# EAGLE schematic SL530 (EAGLE 8.1.1)

## Sheet 1 of 2
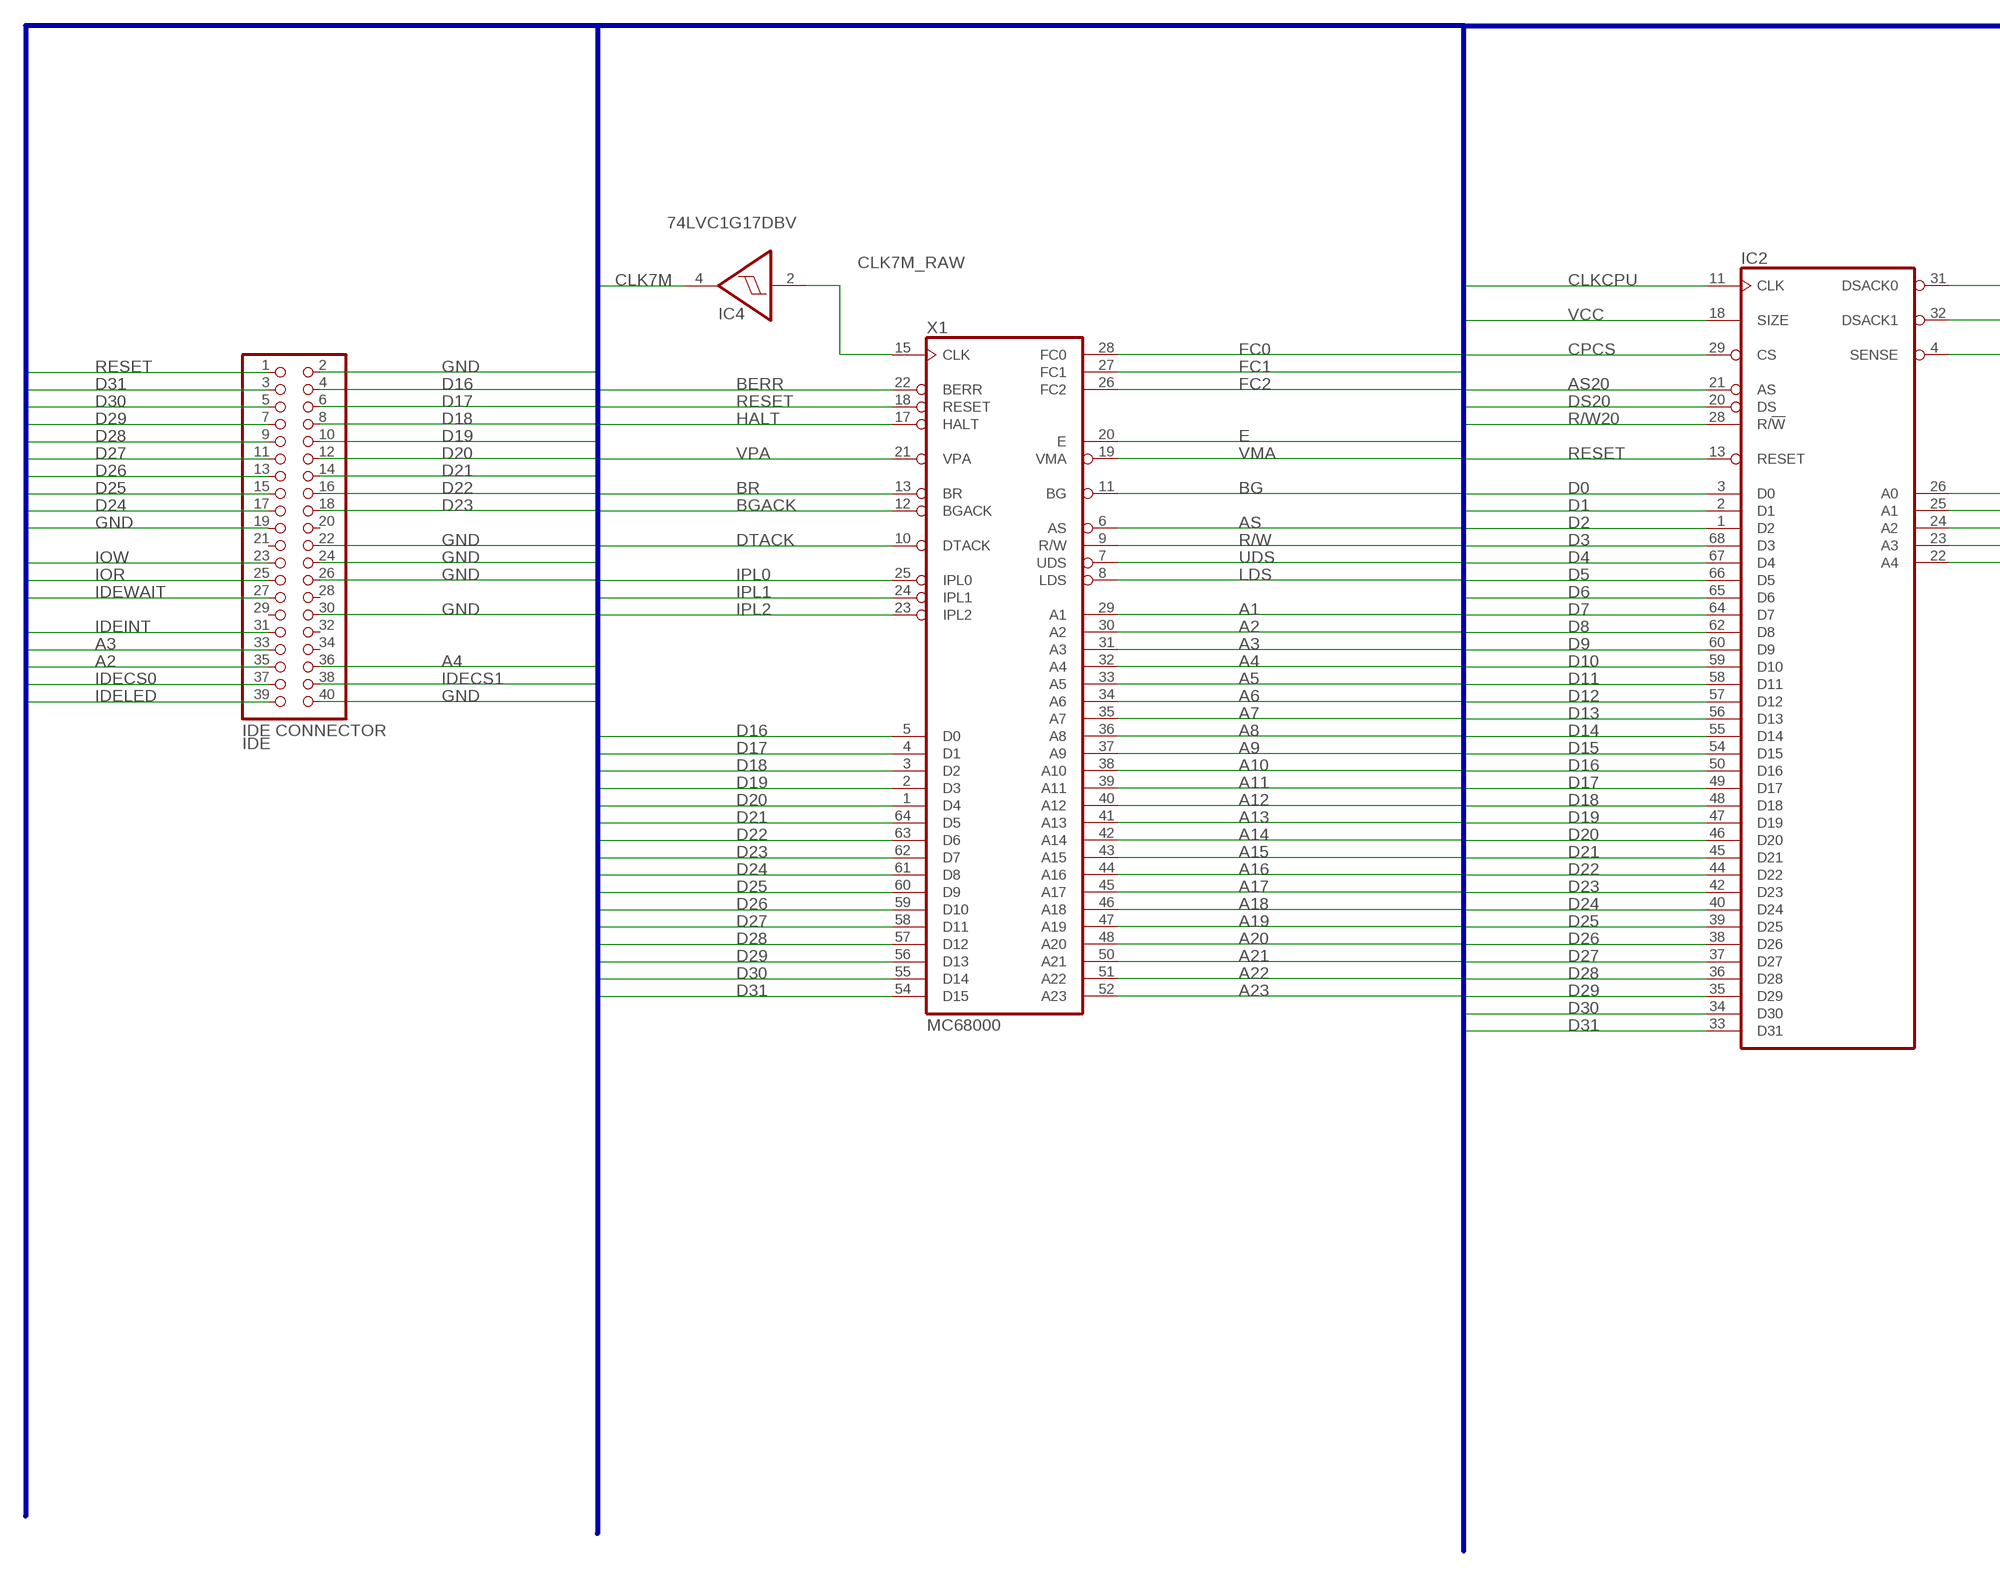
[diagram p0: schematic, sheet 1, part 1 of 2]
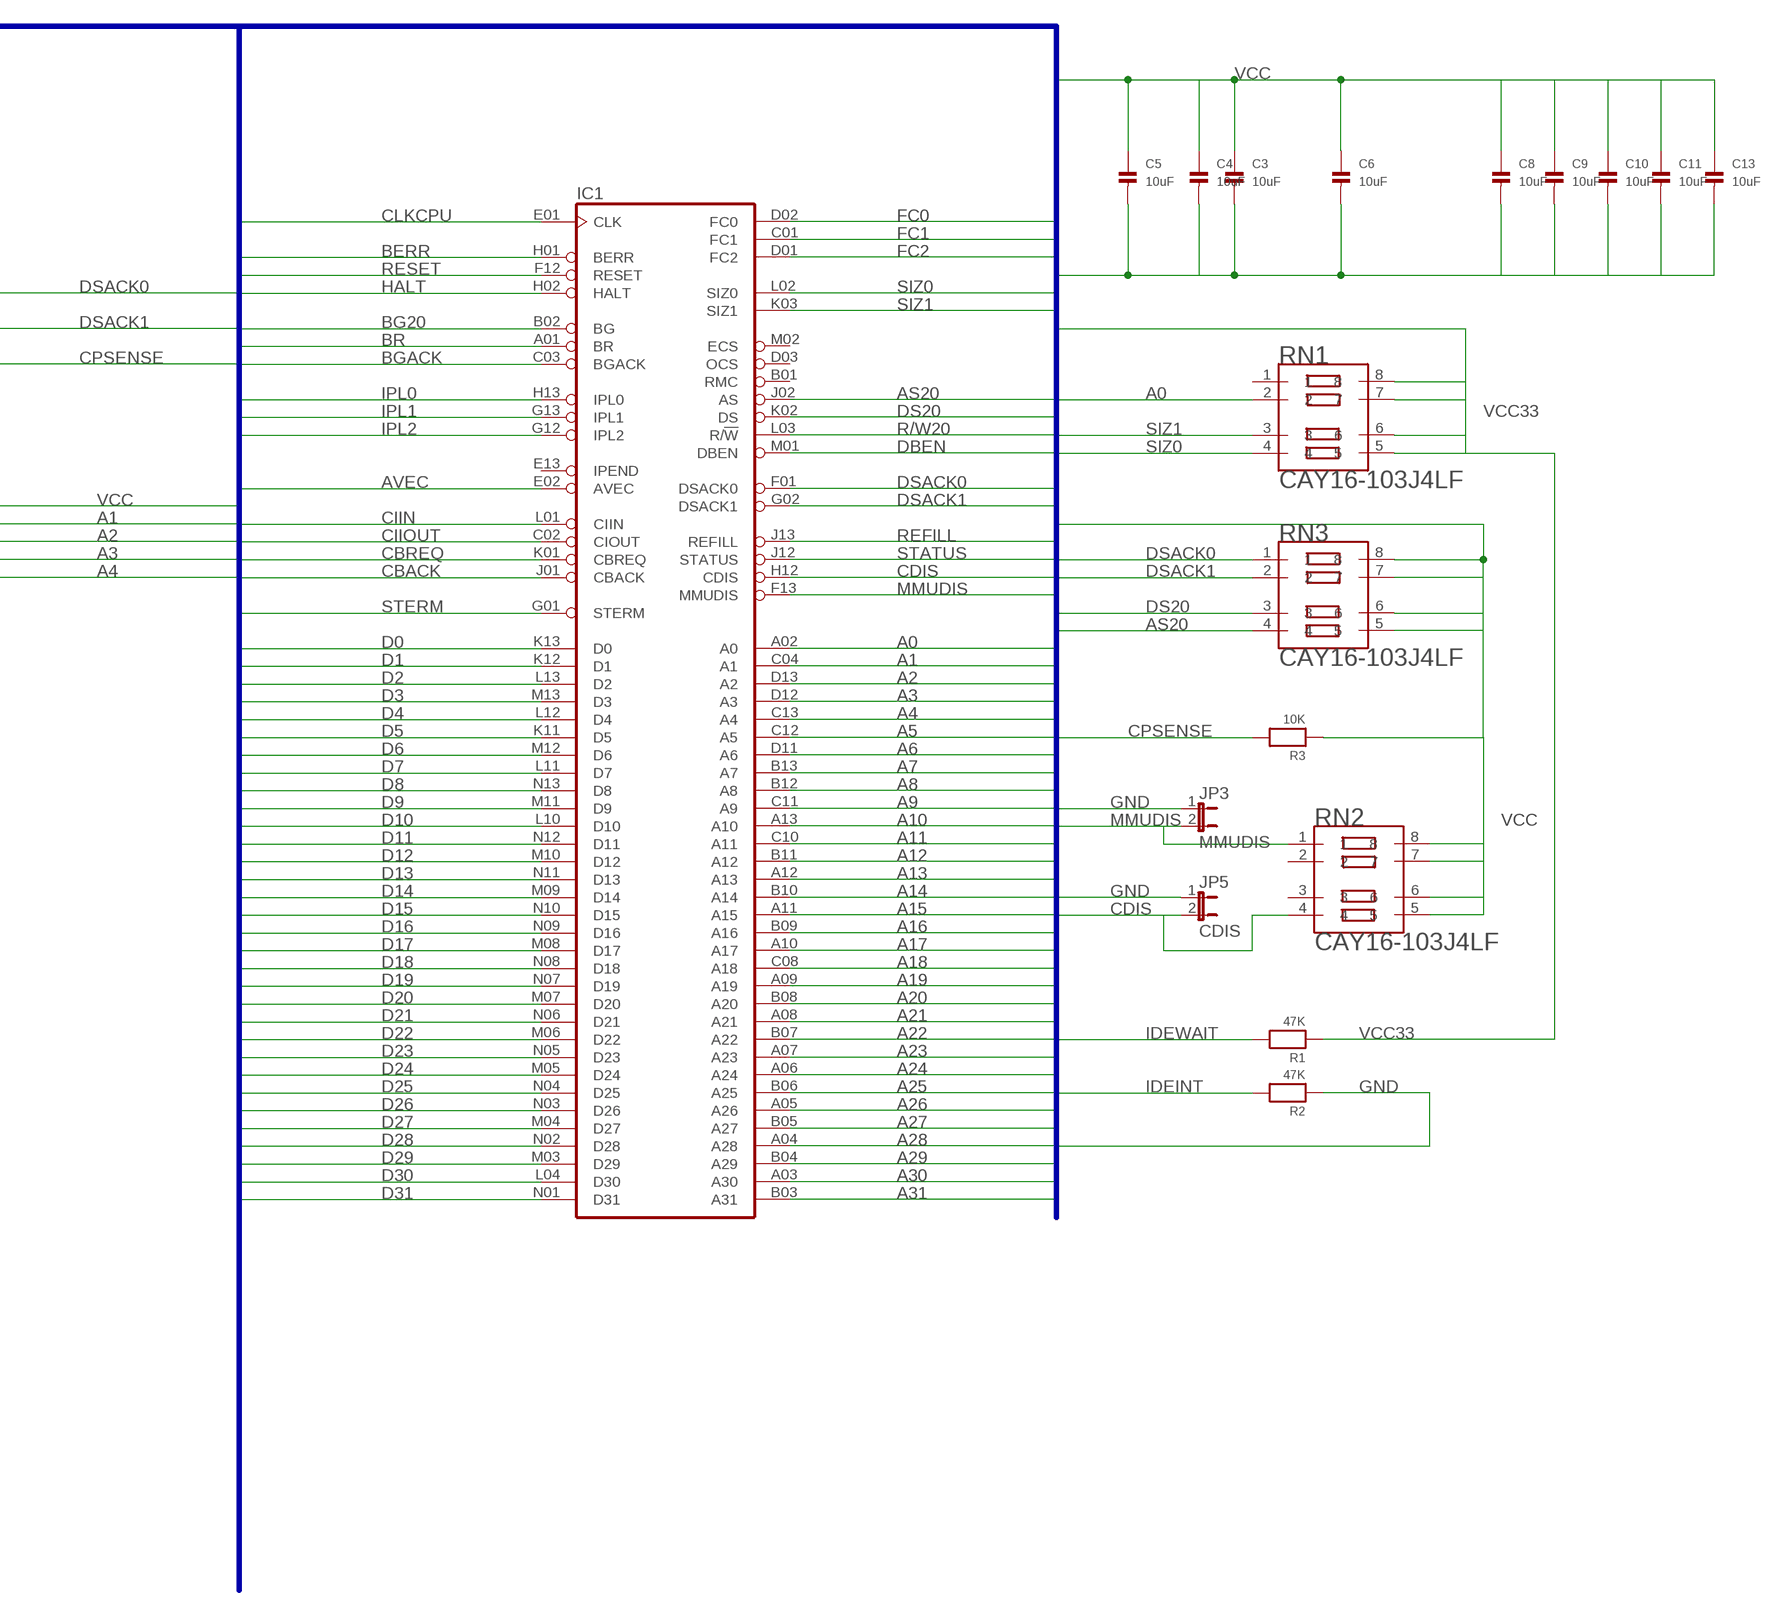
[diagram p1: schematic, sheet 1, part 2 of 2]

### Parts
C3  10uF  CAP_CERAMIC1206  [1206]
C4  10uF  CAP_CERAMIC1206  [1206]
C5  10uF  CAP_CERAMIC1206  [1206]
C6  10uF  CAP_CERAMIC1206  [1206]
C8  10uF  CAP_CERAMIC1206  [1206]
C9  10uF  CAP_CERAMIC1206  [1206]
C10  10uF  CAP_CERAMIC1206  [1206]
C11  10uF  CAP_CERAMIC1206  [1206]
C13  10uF  CAP_CERAMIC1206  [1206]
IC1  MC68030RC  [MPGA128]
IC2  MC68881FN-SOC  [PLCC68-S]
IC4  74LVC1G17DBV  [SOT23-5]
IDE  IDE CONNECTOR  PINHD-2X20  [2X20]
JP3  MMUDIS  JUMPER-2PTH  [1X02]
JP5  CDIS  JUMPER-2PTH  [1X02]
R1  47K  RESISTOR1206  [1206]
R2  47K  RESISTOR1206  [1206]
R3  10K  RESISTOR1206  [1206]
RN1  CAY16-103J4LF  [RESCAXE80P320X160-8N]
RN2  CAY16-103J4LF  [RESCAXE80P320X160-8N]
RN3  CAY16-103J4LF  [RESCAXE80P320X160-8N]
X1  MC68000  MC68000P  [DIL64]

### Nets
A0: IC1.A02(A0) RN1.2 ; also sheet 2
A1: IC1.C04(A1) IC2.25(A1) X1.29(A1) ; also sheet 2
A2: IC1.D13(A2) IC2.24(A2) IDE.35 X1.30(A2) ; also sheet 2
A3: IC1.D12(A3) IC2.23(A3) IDE.33 X1.31(A3) ; also sheet 2
A4: IC1.C13(A4) IC2.22(A4) IDE.36 X1.32(A4) ; also sheet 2
A5: IC1.C12(A5) X1.33(A5) ; also sheet 2
A6: IC1.D11(A6) X1.34(A6) ; also sheet 2
A7: IC1.B13(A7) X1.35(A7) ; also sheet 2
A8: IC1.B12(A8) X1.36(A8) ; also sheet 2
A9: IC1.C11(A9) X1.37(A9) ; also sheet 2
A10: IC1.A13(A10) X1.38(A10) ; also sheet 2
A11: IC1.C10(A11) X1.39(A11) ; also sheet 2
A12: IC1.B11(A12) X1.40(A12) ; also sheet 2
A13: IC1.A12(A13) X1.41(A13) ; also sheet 2
A14: IC1.B10(A14) X1.42(A14) ; also sheet 2
A15: IC1.A11(A15) X1.43(A15) ; also sheet 2
A16: IC1.B09(A16) X1.44(A16) ; also sheet 2
A17: IC1.A10(A17) X1.45(A17) ; also sheet 2
A18: IC1.C08(A18) X1.46(A18) ; also sheet 2
A19: IC1.A09(A19) X1.47(A19) ; also sheet 2
A20: IC1.B08(A20) X1.48(A20) ; also sheet 2
A21: IC1.A08(A21) X1.50(A21) ; also sheet 2
A22: IC1.B07(A22) X1.51(A22) ; also sheet 2
A23: IC1.A07(A23) X1.52(A23) ; also sheet 2
A24: IC1.A06(A24)
A25: IC1.B06(A25)
A26: IC1.A05(A26)
A27: IC1.B05(A27)
A28: IC1.A04(A28)
A29: IC1.B04(A29)
A30: IC1.A03(A30)
A31: IC1.B03(A31)
AS: X1.6(AS) ; also sheet 2
AS20: IC1.J02(AS) IC2.21(AS) RN3.4 ; also sheet 2
AVEC: IC1.E02(AVEC) ; also sheet 2
BERR: IC1.H01(BERR) X1.22(BERR) ; also sheet 2
BG: X1.11(BG) ; also sheet 2
BG20: IC1.B02(BG) ; also sheet 2
BGACK: IC1.C03(BGACK) X1.12(BGACK) ; also sheet 2
BR: IC1.A01(BR) X1.13(BR)
CBACK: IC1.J01(CBACK) ; also sheet 2
CBREQ: IC1.K01(CBREQ) ; also sheet 2
CDIS: IC1.H12(CDIS) JP5.2 RN2.4
CIIN: IC1.L01(CIIN) ; also sheet 2
CIIOUT: IC1.C02(CIOUT)
CLK7M: IC4.4(O) ; also sheet 2
CLK7M_RAW: IC4.2(I) X1.15(CLK)
CLKCPU: IC1.E01(CLK) IC2.11(CLK) ; also sheet 2
CPCS: IC2.29(CS) ; also sheet 2
CPSENSE: IC2.4(SENSE) R3.2 ; also sheet 2
D0: IC1.K13(D0) IC2.3(D0) ; also sheet 2
D1: IC1.K12(D1) IC2.2(D1) ; also sheet 2
D2: IC1.L13(D2) IC2.1(D2) ; also sheet 2
D3: IC1.M13(D3) IC2.68(D3) ; also sheet 2
D4: IC1.L12(D4) IC2.67(D4) ; also sheet 2
D5: IC1.K11(D5) IC2.66(D5) ; also sheet 2
D6: IC1.M12(D6) IC2.65(D6) ; also sheet 2
D7: IC1.L11(D7) IC2.64(D7) ; also sheet 2
D8: IC1.N13(D8) IC2.62(D8) ; also sheet 2
D9: IC1.M11(D9) IC2.60(D9) ; also sheet 2
D10: IC1.L10(D10) IC2.59(D10) ; also sheet 2
D11: IC1.N12(D11) IC2.58(D11) ; also sheet 2
D12: IC1.M10(D12) IC2.57(D12) ; also sheet 2
D13: IC1.N11(D13) IC2.56(D13) ; also sheet 2
D14: IC1.M09(D14) IC2.55(D14) ; also sheet 2
D15: IC1.N10(D15) IC2.54(D15) ; also sheet 2
D16: IC1.N09(D16) IC2.50(D16) IDE.4 X1.5(D0) ; also sheet 2
D17: IC1.M08(D17) IC2.49(D17) IDE.6 X1.4(D1) ; also sheet 2
D18: IC1.N08(D18) IC2.48(D18) IDE.8 X1.3(D2) ; also sheet 2
D19: IC1.N07(D19) IC2.47(D19) IDE.10 X1.2(D3) ; also sheet 2
D20: IC1.M07(D20) IC2.46(D20) IDE.12 X1.1(D4) ; also sheet 2
D21: IC1.N06(D21) IC2.45(D21) IDE.14 X1.64(D5) ; also sheet 2
D22: IC1.M06(D22) IC2.44(D22) IDE.16 X1.63(D6) ; also sheet 2
D23: IC1.N05(D23) IC2.42(D23) IDE.18 X1.62(D7) ; also sheet 2
D24: IC1.M05(D24) IC2.40(D24) IDE.17 X1.61(D8) ; also sheet 2
D25: IC1.N04(D25) IC2.39(D25) IDE.15 X1.60(D9) ; also sheet 2
D26: IC1.N03(D26) IC2.38(D26) IDE.13 X1.59(D10) ; also sheet 2
D27: IC1.M04(D27) IC2.37(D27) IDE.11 X1.58(D11) ; also sheet 2
D28: IC1.N02(D28) IC2.36(D28) IDE.9 X1.57(D12) ; also sheet 2
D29: IC1.M03(D29) IC2.35(D29) IDE.7 X1.56(D13) ; also sheet 2
D30: IC1.L04(D30) IC2.34(D30) IDE.5 X1.55(D14) ; also sheet 2
D31: IC1.N01(D31) IC2.33(D31) IDE.3 X1.54(D15) ; also sheet 2
DBEN: IC1.M01(DBEN)
DS20: IC1.K02(DS) IC2.20(DS) RN3.3 ; also sheet 2
DSACK0: IC1.F01(DSACK0) IC2.31(DSACK0) RN3.1 ; also sheet 2
DSACK1: IC1.G02(DSACK1) IC2.32(DSACK1) RN3.2 ; also sheet 2
DTACK: X1.10(DTACK) ; also sheet 2
E: X1.20(E) ; also sheet 2
FC0: IC1.D02(FC0) X1.28(FC0) ; also sheet 2
FC1: IC1.C01(FC1) X1.27(FC1) ; also sheet 2
FC2: IC1.D01(FC2) X1.26(FC2) ; also sheet 2
GND: C3.2 C4.2 C5.2 C6.2 C8.2 C9.2 C10.2 C11.2 C13.2 IDE.2 IDE.19 IDE.22 IDE.24 IDE.26 IDE.30 IDE.40 JP3.1 JP5.1 R2.1 ; also sheet 2
HALT: IC1.H02(HALT) X1.17(HALT) ; also sheet 2
IDECS0: IDE.37 ; also sheet 2
IDECS1: IDE.38 ; also sheet 2
IDEINT: IDE.31 R2.2 ; also sheet 2
IDELED: IDE.39
IDEWAIT: IDE.27 R1.2 ; also sheet 2
IOR: IDE.25 ; also sheet 2
IOW: IDE.23 ; also sheet 2
IPL0: IC1.H13(IPL0) X1.25(IPL0)
IPL1: IC1.G13(IPL1) X1.24(IPL1)
IPL2: IC1.G12(IPL2) X1.23(IPL2)
LDS: X1.8(LDS) ; also sheet 2
MMUDIS: IC1.F13(MMUDIS) JP3.2 RN2.1
R/W: X1.9(R/W) ; also sheet 2
R/W20: IC1.L03(R/!W) IC2.28(R/!W) ; also sheet 2
REFILL: IC1.J13(REFILL)
RESET: IC1.F12(RESET) IC2.13(RESET) IDE.1 X1.18(RESET) ; also sheet 2
SIZ0: IC1.L02(SIZ0) RN1.4 ; also sheet 2
SIZ1: IC1.K03(SIZ1) RN1.3 ; also sheet 2
STATUS: IC1.J12(STATUS)
STERM: IC1.G01(STERM) ; also sheet 2
UDS: X1.7(UDS) ; also sheet 2
VCC: C3.1 C4.1 C5.1 C6.1 C8.1 C9.1 C10.1 C11.1 C13.1 IC2.18(SIZE) IC2.26(A0) R3.1 RN2.5 RN2.6 RN2.7 RN2.8 RN3.5 RN3.6 RN3.7 RN3.8 ; also sheet 2
VCC33: R1.1 RN1.5 RN1.6 RN1.7 RN1.8 ; also sheet 2
VMA: X1.19(VMA) ; also sheet 2
VPA: X1.21(VPA) ; also sheet 2
Unconnected: IC1.B01(RMC) IC1.D03(OCS) IC1.E13(IPEND) IC1.M02(ECS) IDE.20 IDE.21 IDE.28 IDE.29 IDE.32 IDE.34 RN1.1 RN2.2 RN2.3

### Buses
VCC33,VCC,GND,CLK7M,A[0..31],D[0..31],IPL[0..2],FC[0..2],DSACK[0..1],BR,BGACK,R/W20,R/W,CLKCPU,AS20,DS20,BG20,AVEC,SIZ[0..1],DBEN,BERR,RESET,HALT,BG,VPA,VMA,E,AS,UDS,LDS,DTACK,CPCS,CPSENSE,CDIS,MMUDIS,IOR,IOW,INT2,IDECS[0..1],IDELED,IDEWAIT,IDEINT,RAMOE,RAMCS[0..3],INTSIG[0..4],TCK,TMS,TDI,TDO,TDINT,OVL,CIIN,CIIOUT,CBREQ,CBACK,STERM,STATUS,REFILL,SPI_MOSI,SPI_MISO,SPI_CLK,SPI_CS[0..1],UNDECIDED

## Sheet 2 of 2
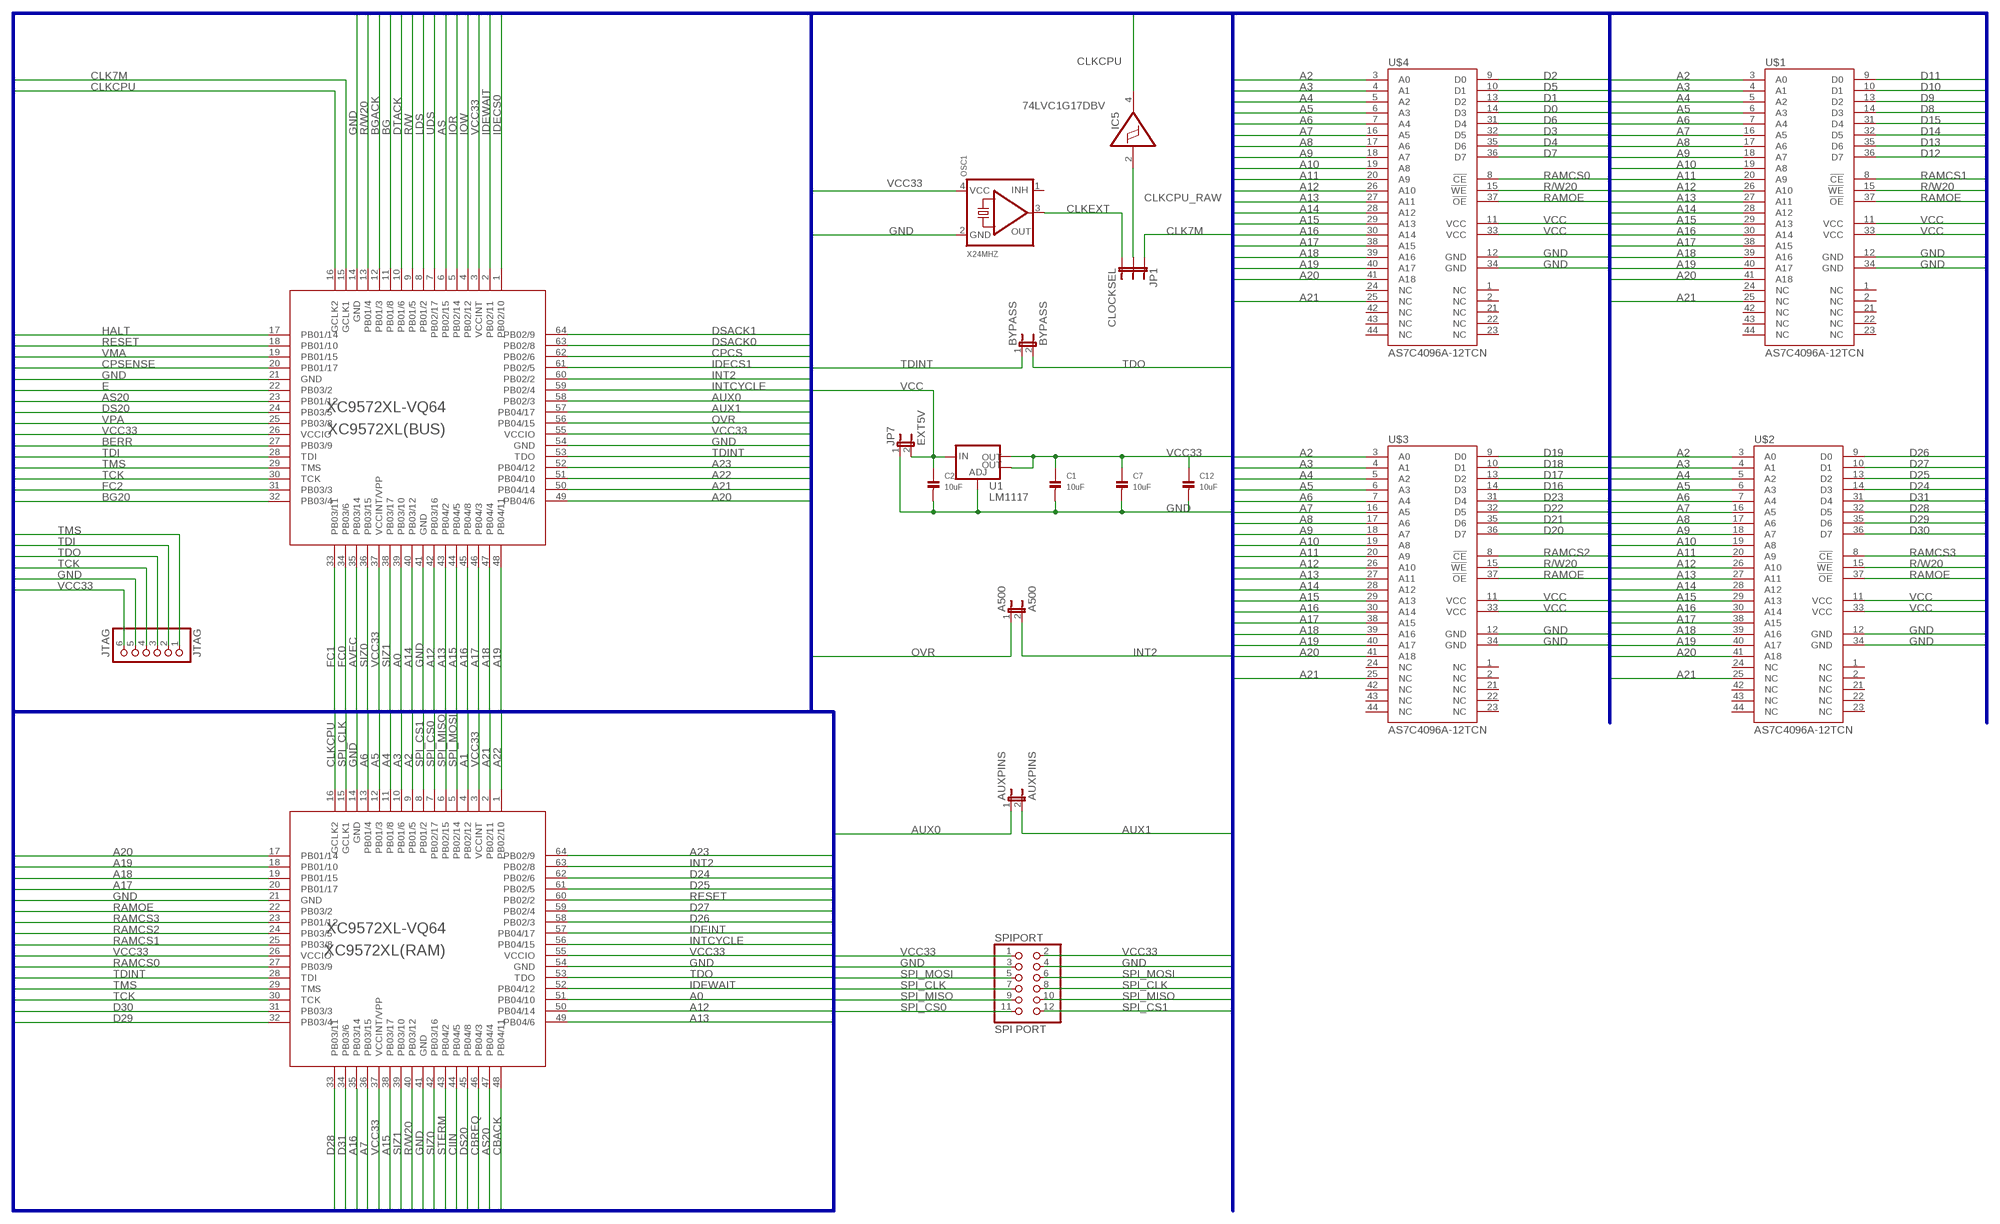
[diagram p2: schematic, sheet 2]

### Parts
A500  A500  JUMPER-2PTH  [1X02]
AUXPINS  AUXPINS  JUMPER-2PTH  [1X02]
BYPASS  BYPASS  JUMPER-2PTH  [1X02]
C1  10uF  CAP_CERAMIC1206  [1206]
C2  10uF  CAP_CERAMIC1206  [1206]
C7  10uF  CAP_CERAMIC1206  [1206]
C12  10uF  CAP_CERAMIC1206  [1206]
IC5  74LVC1G17DBV  [SOT23-5]
JP1  CLOCKSEL  JUMPER-3PTH  [1X03]
JP7  EXT5V  JUMPER-2PTH  [1X02]
JTAG  JTAG  HEADER-1X6ROUND  [1X06_ROUND]
OSC1  X24MHZ  OSCILLATOR  [OSC_7X5MM]
SPIPORT  SPI PORT  PINHD-2X6  [2X06]
U1  LM1117  V_REG_LM1117SOT223  [SOT223]
U$1  AS7C4096A-12TCN  [TSOP44-II]
U$2  AS7C4096A-12TCN  [TSOP44-II]
U$3  AS7C4096A-12TCN  [TSOP44-II]
U$4  AS7C4096A-12TCN  [TSOP44-II]
XC9572XL(BUS)  XC9572XL-VQ64  [VQ64]
XC9572XL(RAM)  XC9572XL-VQ64  [VQ64]

### Nets
A0: XC9572XL(BUS).39(PB03/10) XC9572XL(RAM).51(PB04/10) ; also sheet 1
A1: XC9572XL(RAM).4(PB02/12) ; also sheet 1
A2: U$1.3(A0) U$2.3(A0) U$3.3(A0) U$4.3(A0) XC9572XL(RAM).9(PB01/5) ; also sheet 1
A3: U$1.4(A1) U$2.4(A1) U$3.4(A1) U$4.4(A1) XC9572XL(RAM).10(PB01/6) ; also sheet 1
A4: U$1.5(A2) U$2.5(A2) U$3.5(A2) U$4.5(A2) XC9572XL(RAM).11(PB01/8) ; also sheet 1
A5: U$1.6(A3) U$2.6(A3) U$3.6(A3) U$4.6(A3) XC9572XL(RAM).12(PB01/3) ; also sheet 1
A6: U$1.7(A4) U$2.7(A4) U$3.7(A4) U$4.7(A4) XC9572XL(RAM).13(PB01/4) ; also sheet 1
A7: U$1.16(A5) U$2.16(A5) U$3.16(A5) U$4.16(A5) XC9572XL(RAM).36(PB03/15) ; also sheet 1
A8: U$1.17(A6) U$2.17(A6) U$3.17(A6) U$4.17(A6) ; also sheet 1
A9: U$1.18(A7) U$2.18(A7) U$3.18(A7) U$4.18(A7) ; also sheet 1
A10: U$1.19(A8) U$2.19(A8) U$3.19(A8) U$4.19(A8) ; also sheet 1
A11: U$1.20(A9) U$2.20(A9) U$3.20(A9) U$4.20(A9) ; also sheet 1
A12: U$1.26(A10) U$2.26(A10) U$3.26(A10) U$4.26(A10) XC9572XL(BUS).42(PB03/16) XC9572XL(RAM).50(PB04/14) ; also sheet 1
A13: U$1.27(A11) U$2.27(A11) U$3.27(A11) U$4.27(A11) XC9572XL(BUS).43(PB04/2) XC9572XL(RAM).49(PB04/6) ; also sheet 1
A14: U$1.28(A12) U$2.28(A12) U$3.28(A12) U$4.28(A12) XC9572XL(BUS).40(PB03/12) ; also sheet 1
A15: U$1.29(A13) U$2.29(A13) U$3.29(A13) U$4.29(A13) XC9572XL(BUS).44(PB04/5) XC9572XL(RAM).38(PB03/17) ; also sheet 1
A16: U$1.30(A14) U$2.30(A14) U$3.30(A14) U$4.30(A14) XC9572XL(BUS).45(PB04/8) XC9572XL(RAM).35(PB03/14) ; also sheet 1
A17: U$1.38(A15) U$2.38(A15) U$3.38(A15) U$4.38(A15) XC9572XL(BUS).46(PB04/3) XC9572XL(RAM).20(PB01/17) ; also sheet 1
A18: U$1.39(A16) U$2.39(A16) U$3.39(A16) U$4.39(A16) XC9572XL(BUS).47(PB04/4) XC9572XL(RAM).19(PB01/15) ; also sheet 1
A19: U$1.40(A17) U$2.40(A17) U$3.40(A17) U$4.40(A17) XC9572XL(BUS).48(PB04/11) XC9572XL(RAM).18(PB01/10) ; also sheet 1
A20: U$1.41(A18) U$2.41(A18) U$3.41(A18) U$4.41(A18) XC9572XL(BUS).49(PB04/6) XC9572XL(RAM).17(PB01/14) ; also sheet 1
A21: U$1.25(NC) U$2.25(NC) U$3.25(NC) U$4.25(NC) XC9572XL(BUS).50(PB04/14) XC9572XL(RAM).2(PB02/11) ; also sheet 1
A22: XC9572XL(BUS).51(PB04/10) XC9572XL(RAM).1(PB02/10) ; also sheet 1
A23: XC9572XL(BUS).52(PB04/12) XC9572XL(RAM).64(PB02/9) ; also sheet 1
AS: XC9572XL(BUS).6(PB02/15) ; also sheet 1
AS20: XC9572XL(BUS).23(PB01/12) XC9572XL(RAM).47(PB04/4) ; also sheet 1
AUX0: AUXPINS.1 XC9572XL(BUS).58(PB02/3)
AUX1: AUXPINS.2 XC9572XL(BUS).57(PB04/17)
AVEC: XC9572XL(BUS).35(PB03/14) ; also sheet 1
BERR: XC9572XL(BUS).27(PB03/9) ; also sheet 1
BG: XC9572XL(BUS).11(PB01/8) ; also sheet 1
BG20: XC9572XL(BUS).32(PB03/4) ; also sheet 1
BGACK: XC9572XL(BUS).12(PB01/3) ; also sheet 1
CBACK: XC9572XL(RAM).48(PB04/11) ; also sheet 1
CBREQ: XC9572XL(RAM).46(PB04/3) ; also sheet 1
CIIN: XC9572XL(RAM).44(PB04/5) ; also sheet 1
CLK7M: JP1.1 XC9572XL(BUS).15(GCLK1) ; also sheet 1
CLKCPU: IC5.4(O) XC9572XL(BUS).16(GCLK2) XC9572XL(RAM).16(GCLK2) ; also sheet 1
CLKCPU_RAW: IC5.2(I) JP1.2
CLKEXT: JP1.3 OSC1.3(OUT)
CPCS: XC9572XL(BUS).62(PB02/6) ; also sheet 1
CPSENSE: XC9572XL(BUS).20(PB01/17) ; also sheet 1
D0: U$4.14(D3) ; also sheet 1
D1: U$4.13(D2) ; also sheet 1
D2: U$4.9(D0) ; also sheet 1
D3: U$4.32(D5) ; also sheet 1
D4: U$4.35(D6) ; also sheet 1
D5: U$4.10(D1) ; also sheet 1
D6: U$4.31(D4) ; also sheet 1
D7: U$4.36(D7) ; also sheet 1
D8: U$1.14(D3) ; also sheet 1
D9: U$1.13(D2) ; also sheet 1
D10: U$1.10(D1) ; also sheet 1
D11: U$1.9(D0) ; also sheet 1
D12: U$1.36(D7) ; also sheet 1
D13: U$1.35(D6) ; also sheet 1
D14: U$1.32(D5) ; also sheet 1
D15: U$1.31(D4) ; also sheet 1
D16: U$3.14(D3) ; also sheet 1
D17: U$3.13(D2) ; also sheet 1
D18: U$3.10(D1) ; also sheet 1
D19: U$3.9(D0) ; also sheet 1
D20: U$3.36(D7) ; also sheet 1
D21: U$3.35(D6) ; also sheet 1
D22: U$3.32(D5) ; also sheet 1
D23: U$3.31(D4) ; also sheet 1
D24: U$2.14(D3) XC9572XL(RAM).62(PB02/6) ; also sheet 1
D25: U$2.13(D2) XC9572XL(RAM).61(PB02/5) ; also sheet 1
D26: U$2.9(D0) XC9572XL(RAM).58(PB02/3) ; also sheet 1
D27: U$2.10(D1) XC9572XL(RAM).59(PB02/4) ; also sheet 1
D28: U$2.32(D5) XC9572XL(RAM).33(PB03/11) ; also sheet 1
D29: U$2.35(D6) XC9572XL(RAM).32(PB03/4) ; also sheet 1
D30: U$2.36(D7) XC9572XL(RAM).31(PB03/3) ; also sheet 1
D31: U$2.31(D4) XC9572XL(RAM).34(PB03/6) ; also sheet 1
DS20: XC9572XL(BUS).24(PB03/5) XC9572XL(RAM).45(PB04/8) ; also sheet 1
DSACK0: XC9572XL(BUS).63(PB02/8) ; also sheet 1
DSACK1: XC9572XL(BUS).64(PB02/9) ; also sheet 1
DTACK: XC9572XL(BUS).10(PB01/6) ; also sheet 1
E: XC9572XL(BUS).22(PB03/2) ; also sheet 1
FC0: XC9572XL(BUS).34(PB03/6) ; also sheet 1
FC1: XC9572XL(BUS).33(PB03/11) ; also sheet 1
FC2: XC9572XL(BUS).31(PB03/3) ; also sheet 1
GND: C1.2 C2.2 C7.2 C12.2 JP7.1 JTAG.5 OSC1.2(GND) SPIPORT.3 SPIPORT.4 U1.1(ADJ) U$1.12(GND) U$1.34(GND) U$2.12(GND) U$2.34(GND) U$3.12(GND) U$3.34(GND) U$4.12(GND) U$4.34(GND) XC9572XL(BUS).14(GND) XC9572XL(BUS).21(GND) XC9572XL(BUS).41(GND) XC9572XL(BUS).54(GND) XC9572XL(RAM).14(GND) XC9572XL(RAM).21(GND) XC9572XL(RAM).41(GND) XC9572XL(RAM).54(GND) ; also sheet 1
HALT: XC9572XL(BUS).17(PB01/14) ; also sheet 1
IDECS0: XC9572XL(BUS).1(PB02/10) ; also sheet 1
IDECS1: XC9572XL(BUS).61(PB02/5) ; also sheet 1
IDEINT: XC9572XL(RAM).57(PB04/17) ; also sheet 1
IDEWAIT: XC9572XL(BUS).2(PB02/11) XC9572XL(RAM).52(PB04/12) ; also sheet 1
INT2: A500.2 XC9572XL(BUS).60(PB02/2) XC9572XL(RAM).63(PB02/8)
INTCYCLE: XC9572XL(BUS).59(PB02/4) XC9572XL(RAM).56(PB04/15)
IOR: XC9572XL(BUS).5(PB02/14) ; also sheet 1
IOW: XC9572XL(BUS).4(PB02/12) ; also sheet 1
LDS: XC9572XL(BUS).8(PB01/2) ; also sheet 1
OVR: A500.1 XC9572XL(BUS).56(PB04/15)
R/W: XC9572XL(BUS).9(PB01/5) ; also sheet 1
R/W20: U$1.15(!WE) U$2.15(!WE) U$3.15(!WE) U$4.15(!WE) XC9572XL(BUS).13(PB01/4) XC9572XL(RAM).40(PB03/12) ; also sheet 1
RAMCS0: U$4.8(!CE) XC9572XL(RAM).27(PB03/9)
RAMCS1: U$1.8(!CE) XC9572XL(RAM).25(PB03/8)
RAMCS2: U$3.8(!CE) XC9572XL(RAM).24(PB03/5)
RAMCS3: U$2.8(!CE) XC9572XL(RAM).23(PB01/12)
RAMOE: U$1.37(!OE) U$2.37(!OE) U$3.37(!OE) U$4.37(!OE) XC9572XL(RAM).22(PB03/2)
RESET: XC9572XL(BUS).18(PB01/10) XC9572XL(RAM).60(PB02/2) ; also sheet 1
SIZ0: XC9572XL(BUS).36(PB03/15) XC9572XL(RAM).42(PB03/16) ; also sheet 1
SIZ1: XC9572XL(BUS).38(PB03/17) XC9572XL(RAM).39(PB03/10) ; also sheet 1
SPI_CLK: SPIPORT.7 SPIPORT.8 XC9572XL(RAM).15(GCLK1)
SPI_CS0: SPIPORT.11 XC9572XL(RAM).7(PB02/17)
SPI_CS1: SPIPORT.12 XC9572XL(RAM).8(PB01/2)
SPI_MISO: SPIPORT.9 SPIPORT.10 XC9572XL(RAM).6(PB02/15)
SPI_MOSI: SPIPORT.5 SPIPORT.6 XC9572XL(RAM).5(PB02/14)
STERM: XC9572XL(RAM).43(PB04/2) ; also sheet 1
TCK: JTAG.4 XC9572XL(BUS).30(TCK) XC9572XL(RAM).30(TCK)
TDI: JTAG.2 XC9572XL(BUS).28(TDI)
TDINT: BYPASS.1 XC9572XL(BUS).53(TDO) XC9572XL(RAM).28(TDI)
TDO: BYPASS.2 JTAG.3 XC9572XL(RAM).53(TDO)
TMS: JTAG.1 XC9572XL(BUS).29(TMS) XC9572XL(RAM).29(TMS)
UDS: XC9572XL(BUS).7(PB02/17) ; also sheet 1
VCC: C2.1 JP7.2 U1.3(IN) U$1.11(VCC) U$1.33(VCC) U$2.11(VCC) U$2.33(VCC) U$3.11(VCC) U$3.33(VCC) U$4.11(VCC) U$4.33(VCC) ; also sheet 1
VCC33: C1.1 C7.1 C12.1 JTAG.6 OSC1.4(VCC) SPIPORT.1 SPIPORT.2 U1.2(OUT) U1.4(OUT) XC9572XL(BUS).3(VCCINT) XC9572XL(BUS).26(VCCIO) XC9572XL(BUS).37(VCCINT/VPP) XC9572XL(BUS).55(VCCIO) XC9572XL(RAM).3(VCCINT) XC9572XL(RAM).26(VCCIO) XC9572XL(RAM).37(VCCINT/VPP) XC9572XL(RAM).55(VCCIO) ; also sheet 1
VMA: XC9572XL(BUS).19(PB01/15) ; also sheet 1
VPA: XC9572XL(BUS).25(PB03/8) ; also sheet 1
Unconnected: OSC1.1(INH) U$1.1(NC) U$1.2(NC) U$1.21(NC) U$1.22(NC) U$1.23(NC) U$1.24(NC) U$1.42(NC) U$1.43(NC) U$1.44(NC) U$2.1(NC) U$2.2(NC) U$2.21(NC) U$2.22(NC) U$2.23(NC) U$2.24(NC) U$2.42(NC) U$2.43(NC) U$2.44(NC) U$3.1(NC) U$3.2(NC) U$3.21(NC) U$3.22(NC) U$3.23(NC) U$3.24(NC) U$3.42(NC) U$3.43(NC) U$3.44(NC) U$4.1(NC) U$4.2(NC) U$4.21(NC) U$4.22(NC) U$4.23(NC) U$4.24(NC) U$4.42(NC) U$4.43(NC) U$4.44(NC)

### Buses
VCC33,VCC,GND,CLK7M,A[0..31],D[0..31],IPL[0..2],FC[0..2],DSACK[0..1],BR,BGACK,R/W20,R/W,CLKCPU,AS20,DS20,BG20,AVEC,SIZ[0..1],DBEN,BERR,RESET,HALT,BG,VPA,VMA,E,AS,UDS,LDS,DTACK,CPCS,CPSENSE,CDIS,MMUDIS,IOR,IOW,INT2,IDECS[0..1],IDELED,IDEWAIT,IDEINT,RAMOE,RAMCS[0..3],INTSIG[0..4],TCK,TMS,TDI,TDO,TDINT,OVL,CIIN,CIIOUT,CBREQ,CBACK,STERM,STATUS,REFILL,SPI_MOSI,SPI_MISO,SPI_CLK,SPI_CS[0..1],AUX[0..1]

## Power pins joined to a net without a drawn wire
GND: IC1.C05(GND) IC1.C07(GND) IC1.C09(GND) IC1.E03(GND) IC1.E11(GND) IC1.F03(GND) IC1.G03(GND) IC1.G11(GND) IC1.J03(GND) IC1.J11(GND) IC1.L05(GND) IC1.L07(GND) IC1.L08(GND) IC1.L09(GND) IC2.5(GND) IC2.6(GND) IC2.7(GND) IC2.8(GND) IC2.9(GND) IC2.12(GND) IC2.14(GND) IC2.19(GND) IC2.30(GND) IC2.41(GND) IC2.51(GND) IC2.63(GND) IC4.3(GND) IC5.3(GND) X1.16(GND) X1.53(GND)
VCC: IC1.C06(VCC) IC1.D04(VCC) IC1.D10(VCC) IC1.F02(VCC) IC1.F11(VCC) IC1.H03(VCC) IC1.H11(VCC) IC1.K04(VCC) IC1.K10(VCC) IC1.L06(VCC) IC2.10(VCC) IC2.16(VCC) IC2.17(VCC) IC2.27(VCC) IC2.43(VCC) IC2.52(VCC) IC2.53(VCC) IC2.61(VCC) IC4.5(VCC) IC5.5(VCC) X1.14(VCC) X1.49(VCC)

## Library data of the parts
A500 AUXPINS BYPASS JP3 JP5 JP7 = SparkFun-Retired:JUMPER-2: Jumper Basic 0.1" spaced jumper. Use with breakaway headers.
C1-C13 = microbuilder:CAP_CERAMIC: Ceramic Capacitors 0402 - 0402 Surface Mount Capacitors 16pF 50V 5% [Digikey: 445-4899-2-ND] 18pF 50V 5% [Digikey: 490-1281-2-ND] 22pF 50V 5% [Digikey: 490-1283-2-ND] 68pF 50V 5% [Digikey: 490-1289-2-ND] 0.1uF 10V 10% [Digikey: 490-1318-2-ND] 1.0uF 6.3V 10% [Digikey: 490-1320-2-ND] 0603 - 0603 Surface Mount Capacitors 16 pF 50V 5% [Digikey: 445-5051-2-ND] 22 pF 50V [Digikey: PCC220ACVTR-ND] 33 pF 50V 5% [Digikey: 490-1415-1-ND] 56pF 50V 5% [Digikey: 490-1421-1-ND] 220pF 50V 5% [Digikey: 445-1285-1-ND] 680 pF 50V 2200 pF 50V 5% C0G [Digikey: 445-1297-1-ND] 5600 pF 100V 5% X7R [Digikey: 478-3711-1-ND] 0.1 µF 25V 10% [Digikey: PCC2277TR-ND] 0.22 µF 16V 10% X7R [Digikey: 445-1318-1-ND] 1.0 µF 25V 10% [Digikey: 445-5146-2-ND] 0603 - RF Specific 3pF 250V +/-0.1pF RF [Digikey: 712-1347-1-ND] 18 pF 250V 5% [Digikey: 478-3505-1-ND or 712-1322-1-ND] 56 pF 250V 5% C0G RF [Digikey: 490-4867-1-ND] 68 pF 250V RF [Digikey: 490-4868-1-ND] 0805 - 0805 Surface Mount Capacitors 220 pF 250V 2% RF Ceramic Capacitor [Digikey: 712-1398-1-ND] 1000 pF 50V 2% NP0 Ceramic Capacitor [Digikey: 478-3760-1-ND] 0.1 µF 25V 10% Ceramic Capacitor [Digikey: PCC1828TR-ND] 1.0 µF 16V 10% Ceramic Capacitor[Digikey: 490-1691-2-ND] 10.0 µF 10V 10% Ceramic Capacitor[Digikey: 709-1228-1-ND] 10.0 uF 16V 10% Ceramic Capacitor [Digikey: 478-5165-2-ND] 47 uF 6.3V 20% Ceramic Capacitor [Digikey: 587-1779-1-ND or 399-5506-1-ND] 1206 - 1206 Surface Mount Capacitors 47uF 10V 20% Ceramic Capacitor [Digikey: 490-5528-1-ND or 399-5508-1-ND or 445-6010-1-ND] 100uF 6.3V -20%, +80% Y5V Ceramic Capacitor (Digikey: 490-4512-1-ND, Mouser: 81-GRM31CF50J107ZE1L)
IC1 = micro-mc68000:MC68030RC: 68xxx PROCESSOR; MF: MOTOROLA; MPN: MC68030RC50C; OC_FARNELL: unknown; OC_NEWARK: 52F3269
IC2 = micro-mc68000:MC68881FN: 68xxx PROCESSOR; OC_FARNELL: unknown; OC_NEWARK: unknown
IC4 IC5 = 74xx-little-de:74*1G17: Single Schmitt-Trigger Buffer
IDE = pinhead:PINHD-2X20: PIN HEADER
JP1 = SparkFun-Retired:JUMPER-3
JTAG = microbuilder:HEADER-1X6: PIN HEADER
OSC1 = microbuilder:OSCILLATOR: Oscillators 3.2x2.5mm SMT 4.0MHz +/- 50ppm, 3.3V, 9mA, -40/+85°C - Digikey: 535-9752-1-ND 50MHz +/- 50ppm, 3.3V, 8mA, -10/+70°C - Digikey: 478-4792-1-ND 5x7mm SMT 4.0MHz +/-20ppm 3.3V, 20mA, -20/+70°C - Digikey: 535-9329-2-ND 50MHz +/- 25ppm 3.3V, 35mA, -40/+85°C - Digikey: 631-1197-1-ND
R1-R3 = microbuilder:RESISTOR: Resistors 0402 - 0402 Surface Mount Package 22 Ohm 1% 1/16W [Digikey: 311-22.0LRTR-ND] 33 Ohm 5% 1/16W 1.0K 5% 1/16W 1.5K 5% 1/16W 2.0K 1% 1/16W 10.0K 1% 1/16W [Digikey: 311-10.0KLRTR-ND] 10.0K 5% 1/16W [Digikey: RMCF0402JT10K0TR-ND] 12.1K 1% 1/16W [Digikey: 311-22.0LRTR-ND] 100.0K 5% 1/16W 0603 - 0603 Surface Mount Package 0 Ohm 1/10 Watt 1% Resistor 15 Ohm 1/10 Watt 1% Resistor 33 Ohm 1/10 Watt 1% Resistor 49.9 Ohm 1/10 Watt 1% Resistor 100 Ohm 1/10 Watt 1% Resistor 150 Ohm 1/10 Watt 1% Resistor 240 Ohm 1/10 Watt 1% Resistor 390 Ohm 1/10 Watt 1% Resistor 560 Ohm 1/10 Watt 1% Resistor 680 Ohm 1/10 Watt 1% Resistor 750 Ohm 1/10 Watt 1% Resistor 1.0K Ohm 1/10 Watt 1% Resistor 1.5K Ohm 1/10 Watt 1% Resistor 2.0K Ohm 1/10 Watt 1% Resistor 2.2K Ohm 1/10 Watt 1% Resistor 3.3K Ohm 1/10 Watt 1% Resistor 4.7K Ohm 1/10 Watt 1% Resistor 10.0K Ohm 1/10 Watt 1% Resistor 12.0K Ohm 1/10 Watt 1% Resistor 12.1K Ohm 1/10 Watt 1% Resistor 20.0K Ohm 1/10 Watt 1% Resistor 33.0K Ohm 1/10 Watt 1% Resistor 100.0K Ohm 1/10 Watt 1% Resistor 0805 - 0805 Surface Mount Package 0 Ohm 1/8 Watt 1% Resistor 33 Ohm 1/8 Watt 1% Resistor 100 Ohm 1/8 Watt 1% Resistor 150 Ohm 1/8 Watt 1% Resistor 200 Ohm 1/8 Watt 1% Resistor 240 Ohm 1/8 Watt 1% Resistor 330 Ohm 1/8 Watt 1% Resistor 390 Ohm 1/8 Watt 1% Resistor 470 Ohm 1/8 Watt 1% Resistor 1.0K Ohm 1/8 Watt 1% Resistor 1.5K Ohm 1/8 Watt 1% Resistor 2.0K Ohm 1/8 Watt 1% Resistor 4.7K Ohm 1/8 Watt 1% Resistor 5.1K Ohm 1/8 Watt 1% Resistor 5.6K Ohm 1/8 Watt 1% Resistor 10.0K Ohm 1/8 Watt 1% Resistor 22.0K Ohm 1/8 Watt 1% Resistor 33.0K Ohm 1/8 Watt 1% Resistor 100K Ohm 1/8 Watt 1% Resistor 1206 - 1206 Surface Mount Package 2012 - 2010 Surface Mount Package 0.11 Ohm 1/2 Watt 1% Resistor - Digikey: RHM.11UCT-ND
RN1-RN3 = CAY16-103J4LF:CAY16-103J4LF: Res Thick Film Array 10K Ohm 5% 200ppm/C ISOL Molded 8-Pin 1206(4 X 0603) Convex SMD Paper T/R; AVAILABILITY: Good; DESCRIPTION: Res Thick Film Array 10K Ohm 5% ?200ppm/C ISOL Molded 8-Pin 1206(4 X 0603) Convex SMD Paper T/R; MF: Bourns; MP: CAY16-103J4LF; PACKAGE: 1206 Bourns; PRICE: 0.02 USD
SPIPORT = pinhead:PINHD-2X6: PIN HEADER
U1 = SparkFun-PowerIC:V_REG_LM1117: Voltage Regulator LM1117 Standard adjustable voltage regulator but in SMD form. Spark Fun Electronics SKU : COM-00595; PROD_ID: VREG-08170
U$1-U$4 = andy:AS7C4096A-12TCN
X1 = terriblefire:MC68000P: 68xxx PROCESSOR; OC_FARNELL: unknown; OC_NEWARK: unknown
XC9572XL(BUS) XC9572XL(RAM) = terriblefire:XC9572XL-VQ64